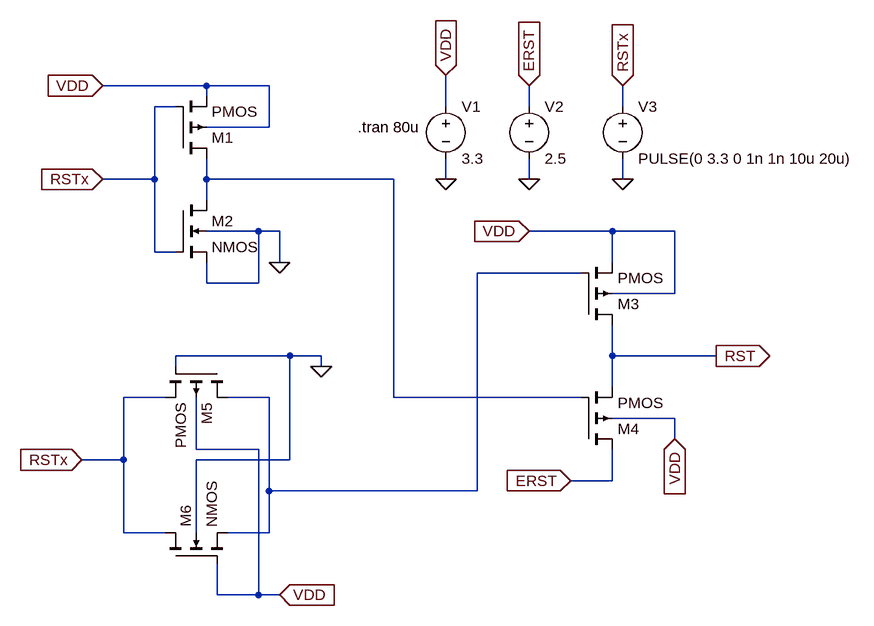
[diagram p0: schematic RST controle.asc]
RST controle.asc, the LTspice schematic file:
Version 4
SHEET 1 1124 848
WIRE -2064 -2608 -2224 -2608
WIRE -1968 -2608 -2064 -2608
WIRE -2064 -2592 -2064 -2608
WIRE -2112 -2576 -2144 -2576
WIRE -1696 -2576 -1696 -2624
WIRE -1568 -2576 -1568 -2608
WIRE -1424 -2576 -1424 -2608
WIRE -1968 -2544 -1968 -2608
WIRE -1968 -2544 -2064 -2544
WIRE -2144 -2464 -2144 -2576
WIRE -2144 -2464 -2224 -2464
WIRE -2064 -2464 -2064 -2496
WIRE -1776 -2464 -2064 -2464
WIRE -1696 -2464 -1696 -2496
WIRE -1568 -2464 -1568 -2496
WIRE -1424 -2464 -1424 -2496
WIRE -2064 -2432 -2064 -2464
WIRE -1984 -2384 -2064 -2384
WIRE -1952 -2384 -1984 -2384
WIRE -1440 -2384 -1568 -2384
WIRE -1344 -2384 -1440 -2384
WIRE -2144 -2352 -2144 -2464
WIRE -2112 -2352 -2144 -2352
WIRE -1952 -2336 -1952 -2384
WIRE -1440 -2336 -1440 -2384
WIRE -1488 -2320 -1648 -2320
WIRE -2064 -2304 -2064 -2336
WIRE -1984 -2304 -1984 -2384
WIRE -1984 -2304 -2064 -2304
WIRE -1344 -2288 -1344 -2384
WIRE -1344 -2288 -1440 -2288
WIRE -1936 -2192 -2112 -2192
WIRE -1888 -2192 -1936 -2192
WIRE -1440 -2192 -1440 -2240
WIRE -1280 -2192 -1440 -2192
WIRE -2112 -2176 -2112 -2192
WIRE -1888 -2176 -1888 -2192
WIRE -1440 -2144 -1440 -2192
WIRE -2128 -2128 -2192 -2128
WIRE -1968 -2128 -2032 -2128
WIRE -1776 -2128 -1776 -2464
WIRE -1488 -2128 -1776 -2128
WIRE -1344 -2096 -1440 -2096
WIRE -1344 -2064 -1344 -2096
WIRE -2080 -2048 -2080 -2128
WIRE -1984 -2048 -2080 -2048
WIRE -2192 -2032 -2192 -2128
WIRE -2192 -2032 -2256 -2032
WIRE -1936 -2032 -1936 -2192
WIRE -1936 -2032 -2080 -2032
WIRE -1440 -2000 -1440 -2048
WIRE -1440 -2000 -1504 -2000
WIRE -1968 -1984 -1968 -2128
WIRE -1648 -1984 -1648 -2320
WIRE -1648 -1984 -1968 -1984
WIRE -2192 -1920 -2192 -2032
WIRE -2128 -1920 -2192 -1920
WIRE -2080 -1920 -2080 -2032
WIRE -1968 -1920 -1968 -1984
WIRE -1968 -1920 -2032 -1920
WIRE -2048 -1824 -2048 -1872
WIRE -1984 -1824 -1984 -2048
WIRE -1984 -1824 -2048 -1824
WIRE -1952 -1824 -1984 -1824
FLAG -1952 -2336 0
FLAG -2224 -2608 VDD
IOPIN -2224 -2608 In
FLAG -2224 -2464 RSTx
IOPIN -2224 -2464 In
FLAG -1696 -2464 0
FLAG -1696 -2624 VDD
IOPIN -1696 -2624 In
FLAG -1568 -2464 0
FLAG -1424 -2464 0
FLAG -1568 -2608 ERST
IOPIN -1568 -2608 In
FLAG -1424 -2608 RSTx
IOPIN -1424 -2608 In
FLAG -1568 -2384 VDD
IOPIN -1568 -2384 In
FLAG -1344 -2064 VDD
IOPIN -1344 -2064 In
FLAG -1504 -2000 ERST
IOPIN -1504 -2000 In
FLAG -1280 -2192 RST
IOPIN -1280 -2192 Out
FLAG -1952 -1824 VDD
IOPIN -1952 -1824 In
FLAG -2256 -2032 RSTx
IOPIN -2256 -2032 In
FLAG -1888 -2176 0
SYMBOL pmos4 -2112 -2496 M180
SYMATTR InstName M1
SYMBOL nmos4 -2112 -2432 R0
SYMATTR InstName M2
SYMBOL voltage -1696 -2592 R0
SYMATTR InstName V1
SYMATTR Value 3.3
SYMBOL voltage -1568 -2592 R0
SYMATTR InstName V2
SYMATTR Value 2.5
SYMBOL voltage -1424 -2592 R0
WINDOW 123 0 0 Left 2
WINDOW 39 0 0 Left 2
SYMATTR InstName V3
SYMATTR Value PULSE(0 3.3 0 1n 1n 10u 20u)
SYMBOL pmos4 -1488 -2240 M180
SYMATTR InstName M3
SYMBOL pmos4 -1488 -2048 M180
SYMATTR InstName M4
SYMBOL pmos4 -2032 -2176 R90
SYMATTR InstName M5
SYMBOL nmos4 -2128 -1872 R270
SYMATTR InstName M6
TEXT -1832 -2544 Left 2 !.tran 80u

The netlist it stands for:
* RST controle.asc
M1 N001 RSTx VDD VDD PMOS
M2 N001 RSTx 0 0 NMOS
V1 VDD 0 3.3
V2 ERST 0 2.5
V3 RSTx 0 PULSE(0 3.3 0 1n 1n 10u 20u)
M3 RST N002 VDD VDD PMOS
M4 ERST N001 RST VDD PMOS
M5 N002 0 RSTx VDD PMOS
M6 RSTx VDD N002 0 NMOS
.model NMOS NMOS
.model PMOS PMOS
.lib standard.mos
.tran 80u
.backanno
.end